# Altium project Arduino_MEGA_2560-Rev3.PrjPcb
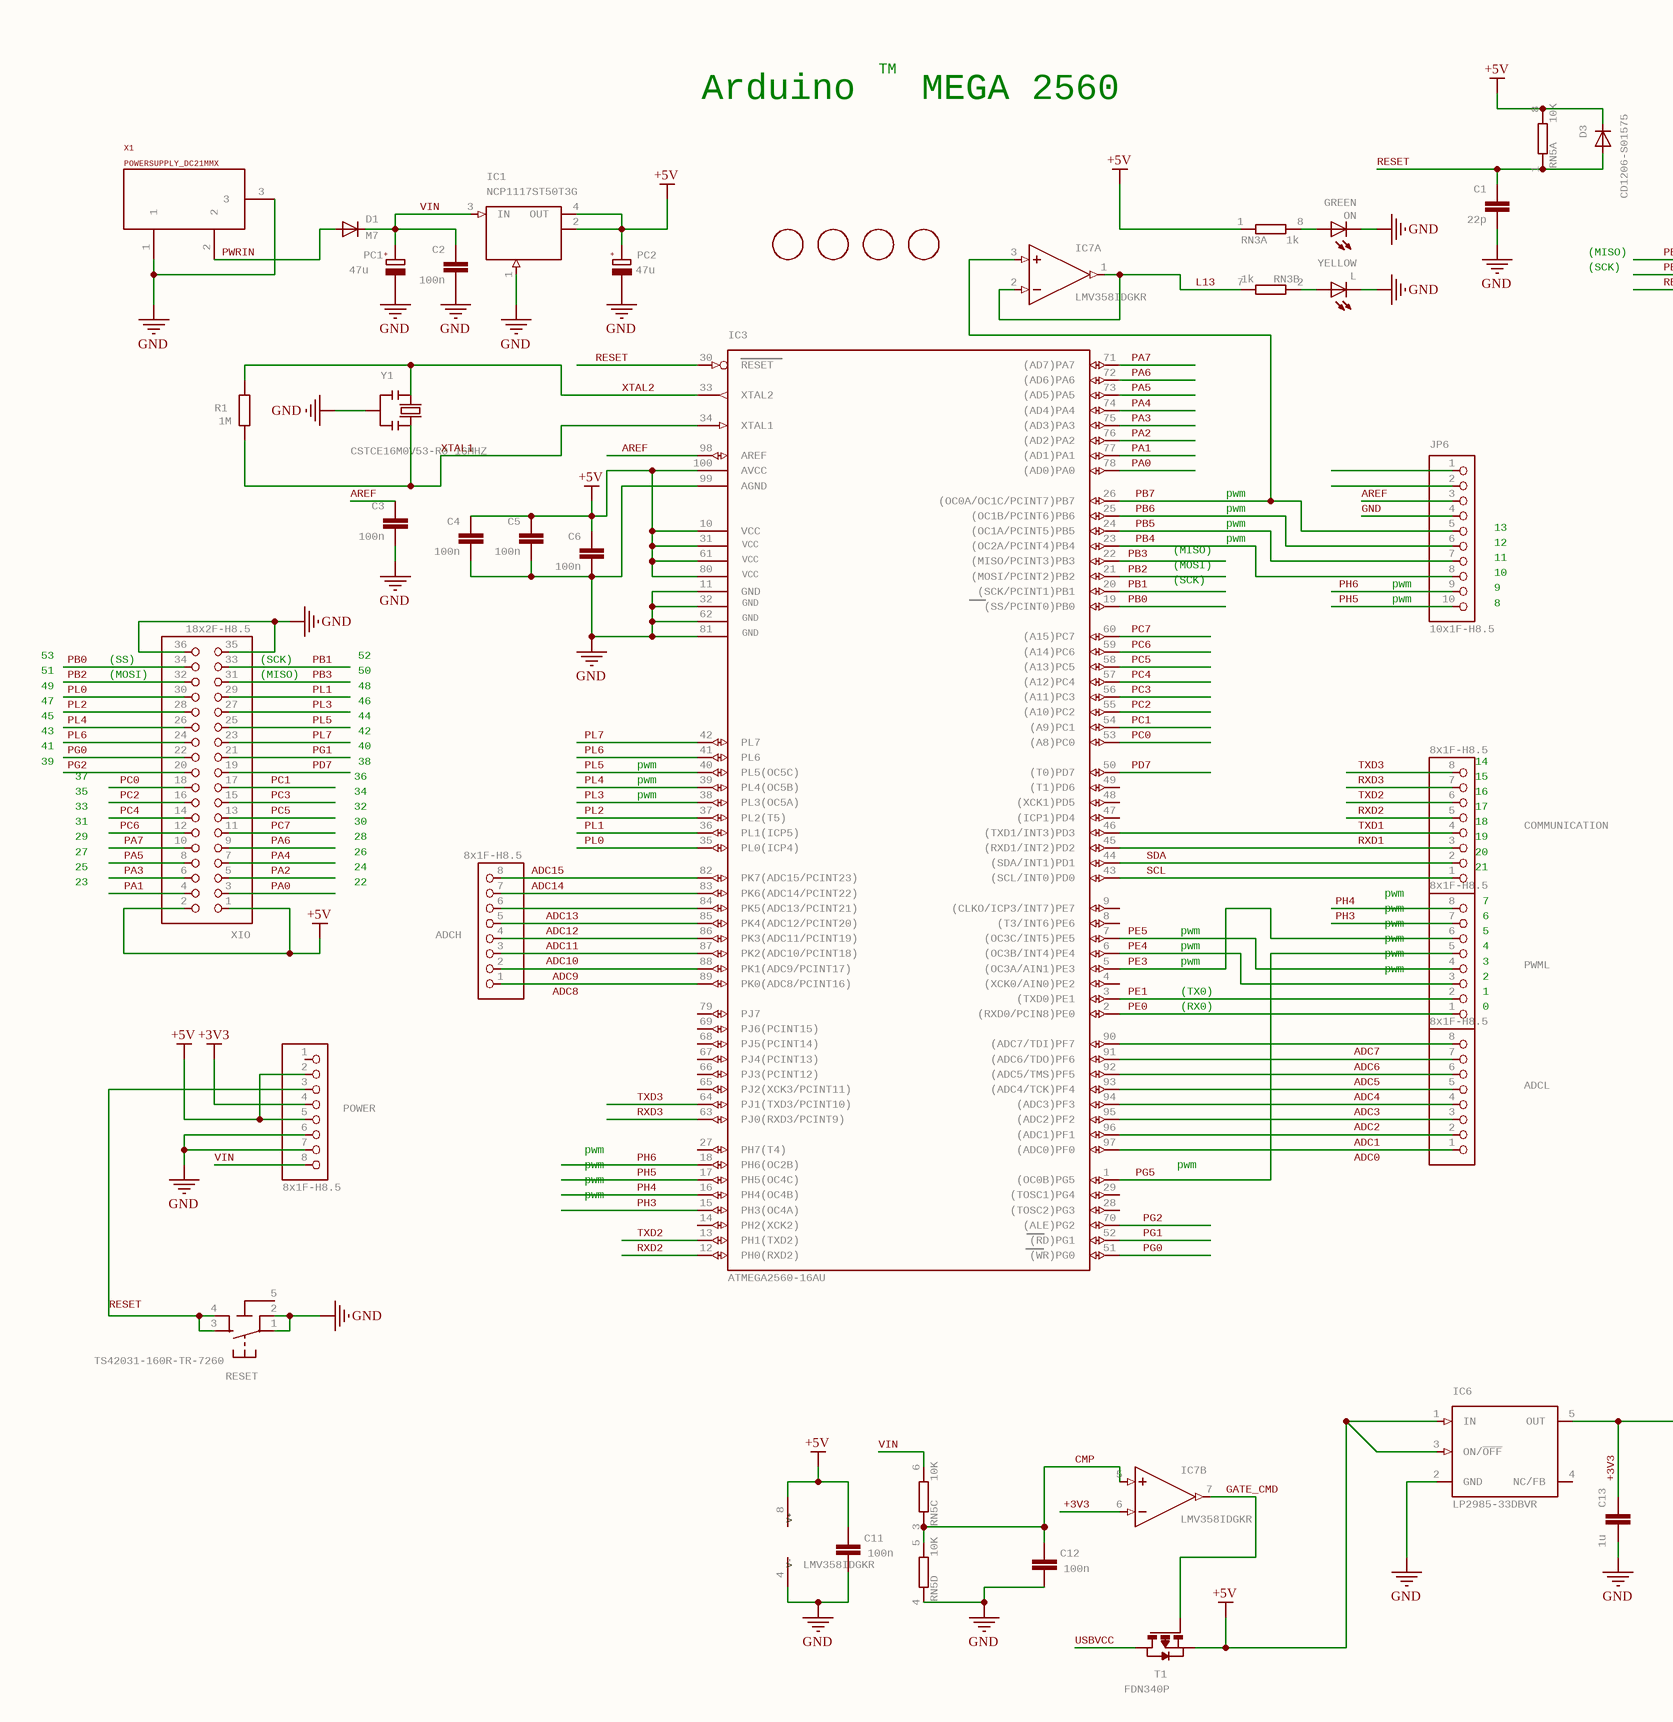
[diagram p0: Arduino_MEGA_2560-Rev3.SchDoc, left]
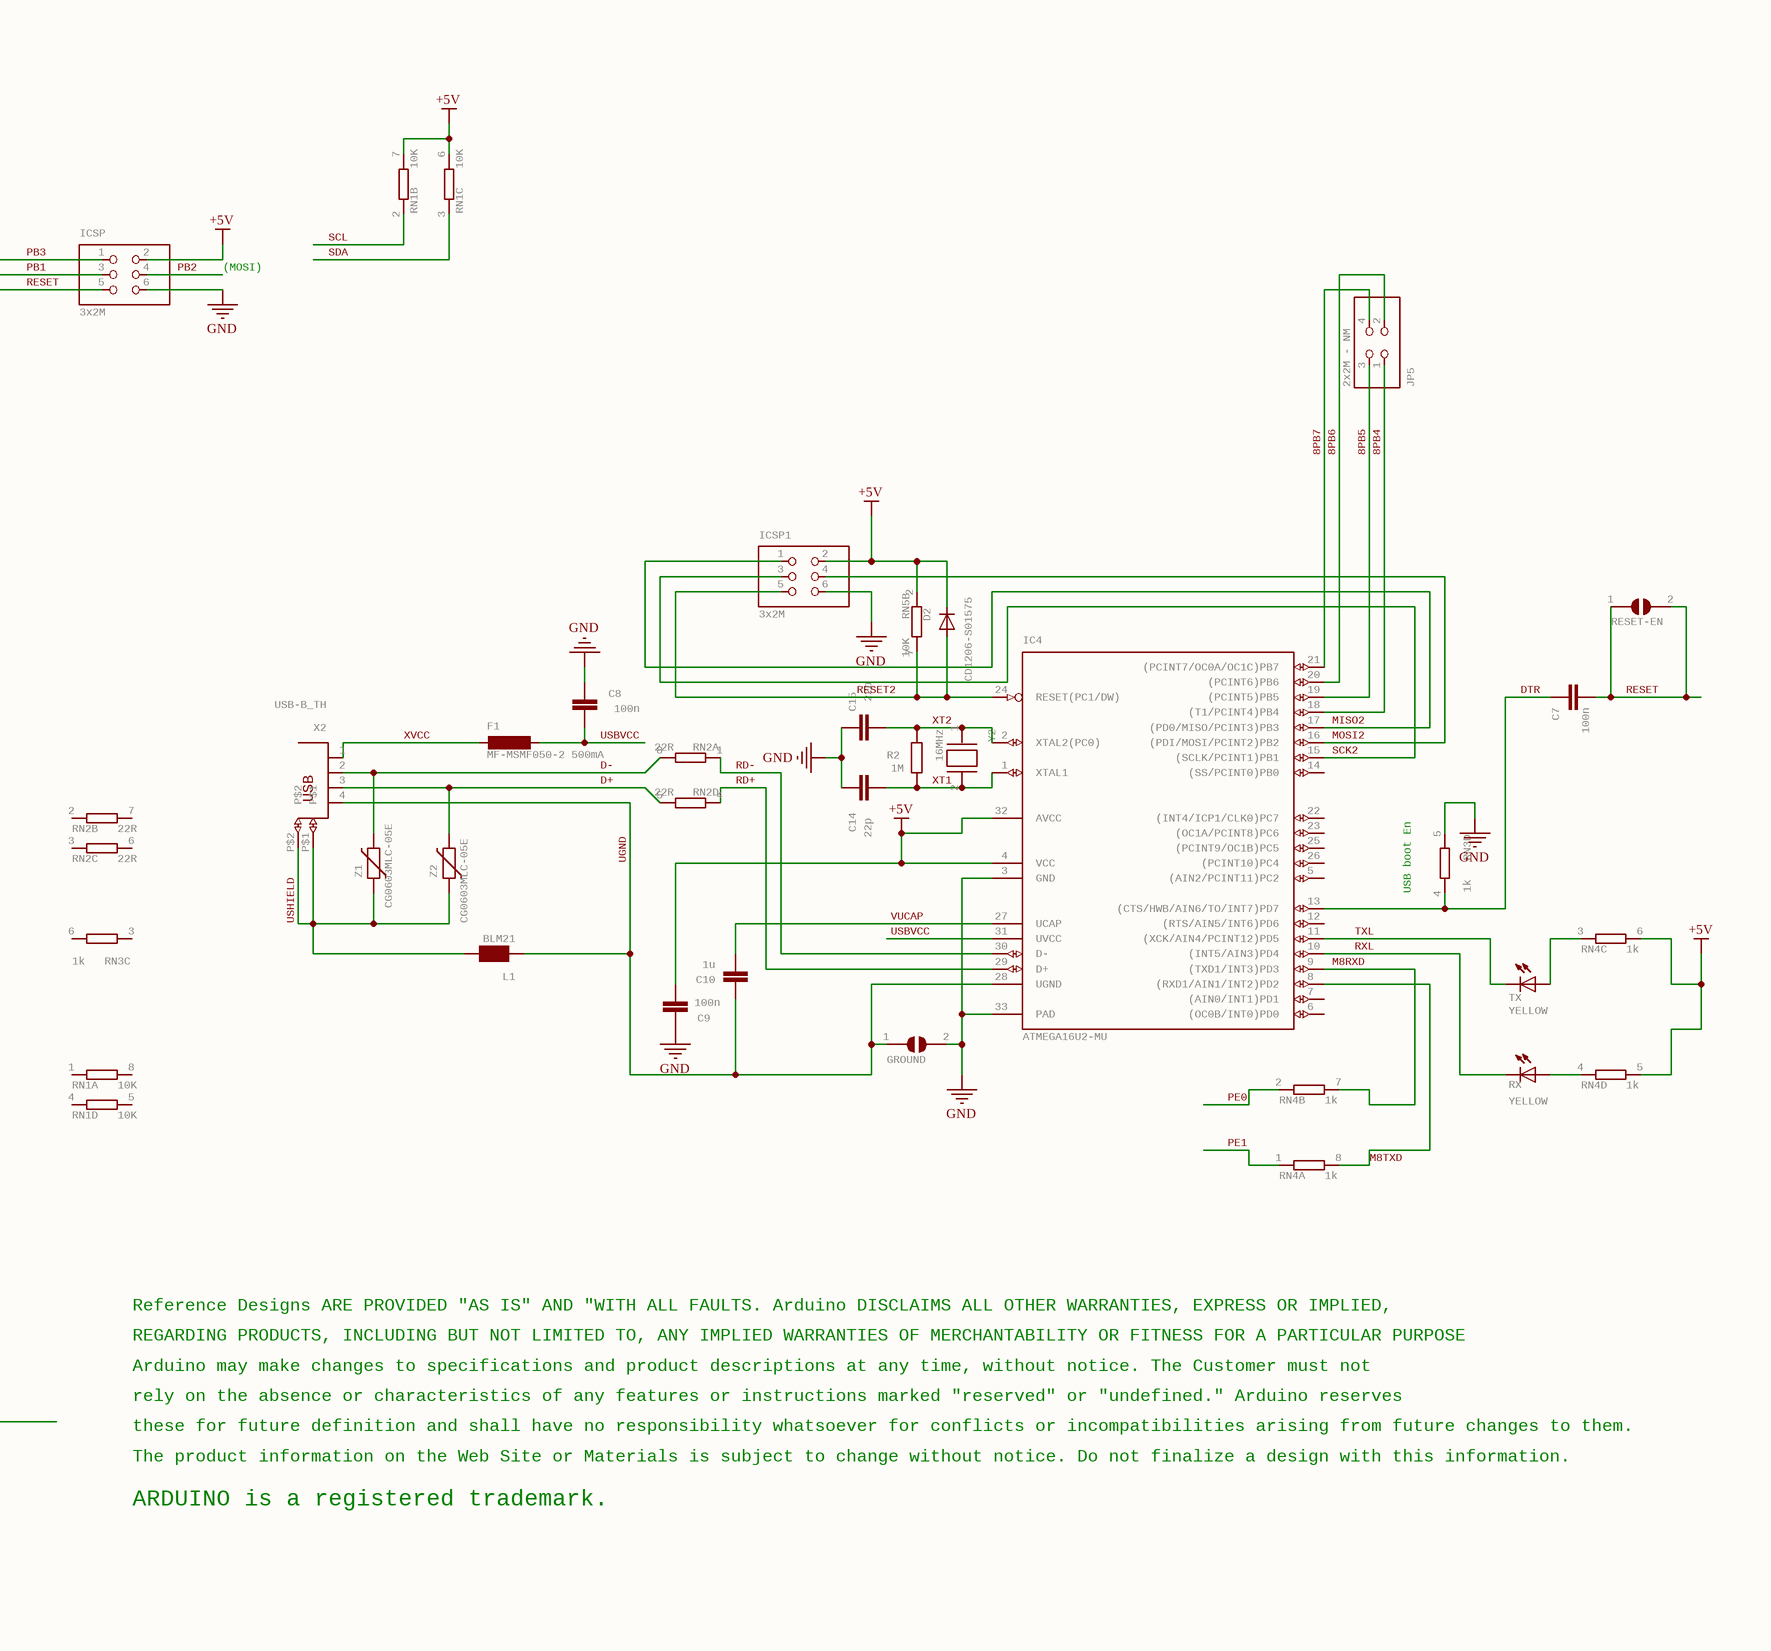
[diagram p1: Arduino_MEGA_2560-Rev3.SchDoc, right]
1 sheet, 63 parts. Net scope: global (net labels, ports and power ports of the same name join across sheets).
Board file: Arduino_MEGA_2560-Rev3.PcbDoc

## Sheet Arduino_MEGA_2560-Rev3.SchDoc
size 586 x 311 mm; Origin: Eagle

### Parts
ADCH  8x1F-H8.5  [1X08]
ADCL  8x1F-H8.5  [1X08]
C1  22p  [C0603-ROUND]
C2  100n  [C0603-ROUND]
C3  100n  [C0603-ROUND]
C4  100n  [C0603-ROUND]
C5  100n  [C0603-ROUND]
C6  100n  [C0603-ROUND]
C7  100n  [C0603-ROUND]
C8  100n  [C0603-ROUND]
C9  100n  [C0603-ROUND]
C10  1u  [C0603-ROUND]
C11  100n  [C0603-ROUND]
C12  100n  [C0603-ROUND]
C13  1u  [C0603-ROUND]
C14  22p  [C0603-ROUND]
C15  22p  [C0603-ROUND]
COMMUNICATION  8x1F-H8.5  [1X08]
D1  M7  [SMB]
D2  CD1206-S01575  [MINIMELF]
D3  CD1206-S01575  [MINIMELF]
F1  MF-MSMF050-2 500mA  [L1812]
FD1  FIDUCIALMOUNT  [FIDUCIA-MOUNT]  (value not drawn)
FD2  FIDUCIALMOUNT  [FIDUCIA-MOUNT]  (value not drawn)
FD3  FIDUCIALMOUNT  [FIDUCIA-MOUNT]  (value not drawn)
FD4  FIDUCIALMOUNT  [FIDUCIA-MOUNT]  (value not drawn)
GROUND  SJ  [SJ]  (value not drawn)
IC1  NCP1117ST50T3G  [SOT223]
IC3  ATMEGA2560-16AU  [TQFP100]
IC4  ATMEGA16U2-MU  [MLF32]
IC6  LP2985-33DBVR  [SOT23-DBV]
IC7  LMV358IDGKR  [MSOP08]  (parts A,B,C of 3)
ICSP  3x2M  [2X03]
ICSP1  3x2M  [2X03]
JP5  2x2M - NM  [2X02]
JP6  10x1F-H8.5  [1X10]
L  YELLOW  [CHIP-LED0805]
L1  BLM21  [0805]
ON  GREEN  [CHIP-LED0805]
PC1  47u  [PANASONIC_D]
PC2  47u  [PANASONIC_D]
POWER  8x1F-H8.5  [1X08]
PWML  8x1F-H8.5  [1X08]
R1  1M  [R0603-ROUND]
R2  1M  [R0603-ROUND]
RESET  TS42031-160R-TR-7260  [TS42]
RESET-EN  SJ  [SJ]  (value not drawn)
RN1  10K  [CAT16]  (parts A,B,C,D of 4)
RN2  22R  [CAY16]  (parts A,B,C,D of 4)
RN3  1k  [CAY16]  (parts A,B,C,D of 4)
RN4  1k  [CAY16]  (parts A,B,C,D of 4)
RN5  10K  [CAT16]  (parts A,B,C,D of 4)
RX  YELLOW  [CHIP-LED0805]
T1  FDN340P  [SOT-23]
TX  YELLOW  [CHIP-LED0805]
U$1  ReferenceDesignsAREPROVIDED"ASIS"AND"WITHALLFAULTS.ArduinoDISCLAIMSALLOTHERWARRANTIES,EXPRESSORIMPLIED,: Reference Designs ARE PROVIDED "AS IS" AND "WITH ALL FAULTS. Arduino DISCLAIMS ALL OTHER WARRANTIES, EXPRESS OR IMPLIED,  Arduinomaymakechangestospecificationsandproductdescriptionsatanytime,withoutnotice.TheCustomermustnot: Arduino may make changes to specifications and product descriptions at any time, without notice. The Customer must not  REGARDINGPRODUCTS,INCLUDINGBUTNOTLIMITEDTO,ANYIMPLIEDWARRANTIESOFMERCHANTABILITYORFITNESSFORAPARTICULARPURPOSE: REGARDING PRODUCTS, INCLUDING BUT NOT LIMITED TO, ANY IMPLIED WARRANTIES OF MERCHANTABILITY OR FITNESS FOR A PARTICULAR PURPOSE  relyontheabsenceorcharacteristicsofanyfeaturesorinstructionsmarked"reserved"or"undefined."Arduinoreserves: rely on the absence or characteristics of any features or instructions marked "reserved" or "undefined." Arduino reserves  theseforfuturedefinitionandshallhavenoresponsibilitywhatsoeverforconflictsorincompatibilitiesarisingfromfuturechangestothem.: these for future definition and shall have no responsibility whatsoever for conflicts or incompatibilities arising from future changes to them.  TheproductinformationontheWebSiteorMaterialsissubjecttochangewithoutnotice.Donotfinalizeadesignwiththisinformation.: The product information on the Web Site or Materials is subject to change without notice. Do not finalize a design with this information.  ARDUINOisaregisteredtrademark.: ARDUINO is a registered trademark.  [DISCLAIMER]  (hidden comment: DISCLAIMER)
X1  POWERSUPPLY_DC21MMX  [POWERSUPPLY_DC-21MM]
X2  USB-B_TH  [PN61729]
XIO  18x2F-H8.5  [2X18]
Y1  CSTCE16M0V53-R0 16MHZ  [RESONATOR]
Y2  16MHz  [QS]
Z1  CG0603MLC-05E  [CT/CN0603]
Z2  CG0603MLC-05E  [CT/CN0603]

### Nets
+3V3: C13.2 IC6.5(OUT) IC7.6(-IN) POWER.4
+5V: C4.1 C5.1 C6.1 C9.1 C11.2 D2.C D3.C IC1.2(OUT) IC1.4(OUT) IC3.10(VCC) IC3.31(VCC1) IC3.61(VCC2) IC3.80(VCC3) IC3.100(AVCC) IC4.4(VCC) IC4.32(AVCC) IC6.1(IN) IC6.3(ON/~{OFF}) IC7.8(V+) ICSP.2 ICSP1.2 PC2.+ POWER.2 POWER.5 RN1.6 RN1.7 RN3.1 RN4.5 RN4.6 RN5.2 RN5.8 T1.2(S) XIO.1 XIO.2
GND: C1.2 C2.2 C3.2 C4.2 C5.2 C6.2 C8.2 C9.2 C11.1 C12.1 C13.1 C14.2 C15.2 GROUND.2 IC1.1(GND/ADJ) IC3.11(GND) IC3.32(GND1) IC3.62(GND2) IC3.81(GND3) IC3.99(AGND) IC4.3(GND) IC4.33(PAD) IC6.2(GND) IC7.4(V-) ICSP.6 ICSP1.6 JP6.4 L.C ON.C PC1.- PC2.- POWER.6 POWER.7 RESET.1 RESET.2 RN3.5 RN5.4 X1.1 X1.3 XIO.35 XIO.36 Y1.2
8PB4: IC4.18((T1/PCINT4)PB4) JP5.1
8PB5: IC4.19((PCINT5)PB5) JP5.3
8PB6: IC4.20((PCINT6)PB6) JP5.2
8PB7: IC4.21((PCINT7/OC0A/OC1C)PB7) JP5.4
ADC0: ADCL.1 IC3.97((ADC0)PF0)
ADC1: ADCL.2 IC3.96((ADC1)PF1)
ADC2: ADCL.3 IC3.95((ADC2)PF2)
ADC3: ADCL.4 IC3.94((ADC3)PF3)
ADC4: ADCL.5 IC3.93((ADC4/TCK)PF4)
ADC5: ADCL.6 IC3.92((ADC5/TMS)PF5)
ADC6: ADCL.7 IC3.91((ADC6/TDO)PF6)
ADC7: ADCL.8 IC3.90((ADC7/TDI)PF7)
ADC8: ADCH.1 IC3.89(PK0(ADC8/PCINT16))
ADC9: ADCH.2 IC3.88(PK1(ADC9/PCINT17))
ADC10: ADCH.3 IC3.87(PK2(ADC10/PCINT18))
ADC11: ADCH.4 IC3.86(PK3(ADC11/PCINT19))
ADC12: ADCH.5 IC3.85(PK4(ADC12/PCINT20))
ADC13: ADCH.6 IC3.84(PK5(ADC13/PCINT21))
ADC14: ADCH.7 IC3.83(PK6(ADC14/PCINT22))
ADC15: ADCH.8 IC3.82(PK7(ADC15/PCINT23))
AREF: C3.1 IC3.98(AREF) JP6.3
CMP: C12.2 IC7.5(+IN) RN5.3 RN5.5
D+: RN2.5 X2.3 Z2.2
D-: RN2.8 X2.2 Z1.2
DTR: C7.1 IC4.13((CTS/HWB/AIN6/TO/INT7)PD7) RN3.4
GATE_CMD: IC7.7(OUT) T1.3(G)
L13: IC7.1(OUT) IC7.2(-IN) RN3.7
M8RXD: IC4.9((TXD1/INT3)PD3) RN4.7
M8TXD: IC4.8((RXD1/AIN1/INT2)PD2) RN4.8
MISO2: IC4.17((PD0/MISO/PCINT3)PB3) ICSP1.1
MOSI2: IC4.16((PDI/MOSI/PCINT2)PB2) ICSP1.4
PA0: IC3.78((AD0)PA0) XIO.3
PA1: IC3.77((AD1)PA1) XIO.4
PA2: IC3.76((AD2)PA2) XIO.5
PA3: IC3.75((AD3)PA3) XIO.6
PA4: IC3.74((AD4)PA4) XIO.7
PA5: IC3.73((AD5)PA5) XIO.8
PA6: IC3.72((AD6)PA6) XIO.9
PA7: IC3.71((AD7)PA7) XIO.10
PB0: IC3.19((SS/PCINT0)PB0) XIO.34
PB1: IC3.20((SCK/PCINT1)PB1) ICSP.3 XIO.33
PB2: IC3.21((MOSI/PCINT2)PB2) ICSP.4 XIO.32
PB3: IC3.22((MISO/PCINT3)PB3) ICSP.1 XIO.31
PB4: IC3.23((OC2A/PCINT4)PB4) JP6.8
PB5: IC3.24((OC1A/PCINT5)PB5) JP6.7
PB6: IC3.25((OC1B/PCINT6)PB6) JP6.6
PB7: IC3.26((OC0A/OC1C/PCINT7)PB7) IC7.3(+IN) JP6.5
PC0: IC3.53((A8)PC0) XIO.18
PC1: IC3.54((A9)PC1) XIO.17
PC2: IC3.55((A10)PC2) XIO.16
PC3: IC3.56((A11)PC3) XIO.15
PC4: IC3.57((A12)PC4) XIO.14
PC5: IC3.58((A13)PC5) XIO.13
PC6: IC3.59((A14)PC6) XIO.12
PC7: IC3.60((A15)PC7) XIO.11
PD7: IC3.50((T0)PD7) XIO.19
PE0: IC3.2((RXD0/PCIN8)PE0) PWML.1 RN4.2
PE1: IC3.3((TXD0)PE1) PWML.2 RN4.1
PE3: IC3.5((OC3A/AIN1)PE3) PWML.6
PE4: IC3.6((OC3B/INT4)PE4) PWML.3
PE5: IC3.7((OC3C/INT5)PE5) PWML.4
PG0: IC3.51((WR)PG0) XIO.22
PG1: IC3.52((RD)PG1) XIO.21
PG2: IC3.70((ALE)PG2) XIO.20
PG5: IC3.1((OC0B)PG5) PWML.5
PH3: IC3.15(PH3(OC4A)) PWML.7
PH4: IC3.16(PH4(OC4B)) PWML.8
PH5: IC3.17(PH5(OC4C)) JP6.10
PH6: IC3.18(PH6(OC2B)) JP6.9
PL0: IC3.35(PL0(ICP4)) XIO.30
PL1: IC3.36(PL1(ICP5)) XIO.29
PL2: IC3.37(PL2(T5)) XIO.28
PL3: IC3.38(PL3(OC5A)) XIO.27
PL4: IC3.39(PL4(OC5B)) XIO.26
PL5: IC3.40(PL5(OC5C)) XIO.25
PL6: IC3.41(PL6) XIO.24
PL7: IC3.42(PL7) XIO.23
PWRIN: D1.A X1.2
RD+: IC4.29(D+) RN2.4
RD-: IC4.30(D-) RN2.1
RESET: C1.1 C7.2 D3.A IC3.30(RESET) ICSP.5 POWER.3 RESET.3 RESET.4 RESET-EN.1 RESET-EN.2 RN5.1
RESET2: D2.A IC4.24(RESET(PC1/DW)) ICSP1.5 RN5.7
RXD1: COMMUNICATION.3 IC3.45((RXD1/INT2)PD2)
RXD2: COMMUNICATION.5 IC3.12(PH0(RXD2))
RXD3: COMMUNICATION.7 IC3.63(PJ0(RXD3/PCINT9))
RXL: IC4.10((INT5/AIN3)PD4) RX.C
SCK2: IC4.15((SCLK/PCINT1)PB1) ICSP1.3
SCL: COMMUNICATION.1 IC3.43((SCL/INT0)PD0) RN1.2
SDA: COMMUNICATION.2 IC3.44((SDA/INT1)PD1) RN1.3
TXD1: COMMUNICATION.4 IC3.46((TXD1/INT3)PD3)
TXD2: COMMUNICATION.6 IC3.13(PH1(TXD2))
TXD3: COMMUNICATION.8 IC3.64(PJ1(TXD3/PCINT10))
TXL: IC4.11((XCK/AIN4/PCINT12)PD5) TX.C
UGND: C10.2 GROUND.1 IC4.28(UGND) L1.1 X2.4
USBVCC: C8.1 F1.1 IC4.31(UVCC) T1.1(D)
USHIELD: L1.2 X2.P$1 X2.P$2 Z1.1 Z2.1
VIN: C2.1 D1.C IC1.3(IN) PC1.+ POWER.8 RN5.6
VUCAP: C10.1 IC4.27(UCAP)
XT1: C14.1 IC4.1(XTAL1) R2.1 Y2.2
XT2: C15.1 IC4.2(XTAL2(PC0)) R2.2 Y2.1
XTAL1: IC3.34(XTAL1) R1.1 Y1.3
XTAL2: IC3.33(XTAL2) R1.2 Y1.1
XVCC: F1.2 X2.1
NetL_A: L.A RN3.2
NetON_A: ON.A RN3.8
NetRN4_3: RN4.3 TX.A
NetRN4_4: RN4.4 RX.A

Not connected (* = marked no-connect by the designer): IC3 4((XCK0/AIN0)PE2) 8((T3/INT6)PE6) 9((CLKO/ICP3/INT7)PE7) 14(PH2(XCK2)) 27(PH7(T4)) 28((TOSC2)PG3) 29((TOSC1)PG4) 47((ICP1)PD4) 48((XCK1)PD5) 49((T1)PD6) 65(PJ2(XCK3/PCINT11)) 66(PJ3(PCINT12)) 67(PJ4(PCINT13)) 68(PJ5(PCINT14)) 69(PJ6(PCINT15)) 79(PJ7); IC4 5((AIN2/PCINT11)PC2) 6((OC0B/INT0)PD0) 7((AIN0/INT1)PD1) 12((RTS/AIN5/INT6)PD6) 14((SS/PCINT0)PB0) 22((INT4/ICP1/CLK0)PC7) 23((OC1A/PCINT8)PC6) 25((PCINT9/OC1B)PC5) 26((PCINT10)PC4); IC6 4(NC/FB); JP6 1 2; POWER 1; RESET 5(5-GND); RN1 1 4(1) 5(2) 8(2); RN2 2(1) 3(1) 6(2) 7(2); RN3 3(1) 6(2)

### Notes on the sheet
- TM
- Arduino   MEGA 2560
- (SCK)
- (MISO)
- (MOSI)
- pwm
- (near JP6) 12
- (near JP6) 13
- (near JP6) pwm
- (near JP6) 8
- (near JP6) 9
- (near JP6) 10
- (near JP6) 11
- 51
- 53
- 49
- (SS)
- (near XIO) (MOSI)
- (near XIO) (SCK)
- (near XIO) (MISO)
- 52
- 50
- 48
- 47
- 45
- 43
- 41
- 39
- 46
- 44
- 42
- 40
- 38
- (near COMMUNICATION) 14
- 29
- 31
- 33
- 35
- 37
- 28
- 30
- 32
- 34
- 36
- (near COMMUNICATION) 15
- (near COMMUNICATION) 16
- (near COMMUNICATION) 17
- (near COMMUNICATION) 18
- (near COMMUNICATION) 19
- 23
- 25
- 27
- 22
- 24
- 26
- (near COMMUNICATION) 20
- (near COMMUNICATION) 21
- (near PWML) 6
- 7
- (near RN3) USB boot En
- (TX0)
- (near PWML) 1
- (near PWML) 2
- (near PWML) 3
- (near PWML) 4
- (near PWML) 5
- (RX0)
- (near PWML) 0

### Library data of the parts
ADCH ADCL COMMUNICATION POWER PWML = PINHD-1X8: PIN HEADER; GateName_1: A; SymbolName_1: PINHD8; LibraryName: SmartPrj; DeviceSetName: PINHD-1X8
C1-C15 = C-EU0603-RND: CAPACITOR, European symbol; GateName_1: G$1; SymbolName_1: C-EU; DeviceName: 0603-RND; LibraryName: SmartPrj; DeviceSetName: C-EU
D1 = DIODE-SMB: DIODE; GateName_1: G$1; SymbolName_1: D; DeviceSetName: DIODE-; DeviceName: SMB; LibraryName: diode
D2 D3 = DIODE-MINIMELF: DIODE; GateName_1: G$1; SymbolName_1: D; DeviceSetName: DIODE-; DeviceName: MINIMELF; LibraryName: diode
F1 = L-EUL1812: INDUCTOR, European symbol; GateName_1: G$1; SymbolName_1: L-EU; DeviceName: L1812; LibraryName: rcl; DeviceSetName: L-EU
FD1-FD4 = FIDUCIALMOUNT: GateName_1: G$1; SymbolName_1: FIDUCIAL; LibraryName: SmartPrj; DeviceSetName: FIDUCIALMOUNT
GROUND RESET-EN = SJ: SMD solder JUMPER; GateName_1: 1; SymbolName_1: SJ; LibraryName: jumper; DeviceSetName: SJ
IC1 = MC33269ST*: Adjustable Output Low Dropout Voltage Regulator 800 mA   Source: http://www.onsemi.com/pub/Collateral/MC33269-D.PDF; GateName_1: G$1; SymbolName_1: VREG-O2; LibraryName: linear; DeviceSetName: MC33269ST*
IC3 = ATMEGA2560AU: MICROCONTROLLER   64/128/256 Kbytes FLASH   4 Kbytes EEPROM   8 Kbytes SRAM   86 General Purpose I/O pins   12-channels16-bit PWM   4 x Serial USARTs   16-channels 10-bit A/D; GateName_1: 1; SymbolName_1: 86-I/O-1; DeviceName: AU; LibraryName: SmartPrj; DeviceSetName: ATMEGA2560; GND: GND; VCC: VCC
IC4 = ATMEGA16U2-MU: GateName_1: G$1; SymbolName_1: ATMEL_MEGA8U2; DeviceName: MU; LibraryName: SmartPrj; DeviceSetName: ATMEGA16U2-
IC6 = LP2985-XXDBVR: ULTRALOW-POWER 50-mA LOW-DROPOUT LINEAR REGULATORS   50-mA Low-Dropout Regulator Source: http://focus.ti.com/lit/ds/symlink/tps77001.pdf; GateName_1: G$1; SymbolName_1: LP2985-XXDBVR; LibraryName: SmartPrj; DeviceSetName: LP2985-XXDBVR
IC7 = LMV358?*MM: Dual General Purpose, Low Voltage, Rail-to-Rail Output Operational Amplifiers   Source: http://www.national.com/mpf/LM/LMV321.html http://www.national.com/dt/lmv_qual.pdf; GateName_1: A; SymbolName_1: OPAMP; GateName_2: B; GateName_3: P; SymbolName_3: PWR+-; DeviceName: MM; SymbolName_2: OPAMP; LibraryName: linear; DeviceSetName: LMV358?*
ICSP ICSP1 = PINHD-2X3: PIN HEADER; GateName_1: A; SymbolName_1: PINH2X3; LibraryName: SmartPrj; DeviceSetName: PINHD-2X3
JP5 = PINHD-2X2: PIN HEADER; GateName_1: A; SymbolName_1: PINH2X2; LibraryName: SmartPrj; DeviceSetName: PINHD-2X2
JP6 = PINHD-1X10_ARD: PIN HEADER; GateName_1: A; SymbolName_1: PINHD10; LibraryName: SmartPrj; DeviceSetName: PINHD-1X10_ARD
L ON RX TX = LEDCHIP-LED0805: LED   OSRAM: - CHIPLED LG R971, LG N971, LY N971, LG Q971, LY Q971, LO R971, LY R971 LH N974, LH R974 LS Q976, LO Q976, LY Q976 LO Q996 - Hyper CHIPLED LW Q18S LB Q993, LB Q99A, LB R99A - SideLED LS A670, LO A670, LY A670, LG A670, LP A670 LB A673, LV A673, LT A673, LW A673 LH A674 LY A675 LS A676, LA A676, LO A676, LY A676, LW A676 LS A679, LY A679, LG A679 -  Hyper Micro SIDELEDÂ® LS Y876, LA Y876, LO Y876, LY Y876 LT Y87S - SmartLED LW L88C, LW L88S LB L89C, LB L89S, LG L890 LS L89K, LO L89K, LY L89K LS L896, LA L896, LO L896, LY L896 - TOPLED LS T670, LO T670, LY T670, LG T670, LP T670 LSG T670, LSP T670, LSY T670, LOP T670, LYG T670 LG T671, LOG T671, LSG T671 LB T673, LV T673, LT T673, LW T673 LH T674 LS T676, LA T676, LO T676, LY T676, LB T676, LH T676, LSB T676, LW T676 LB T67C, LV T67C, LT T67C, LS T67K, LO T67K, LY T67K, LW E67C LS E67B, LA E67B, LO E67B, LY E67B, LB E67C, LV E67C, LT E67C LW T67C LS T679, LY T679, LG T679 LS T770, LO T770, LY T770, LG T770, LP T770 LB T773, LV T773, LT T773, LW T773 LH T774 LS E675, LA E675, LY E675, LS T675 LS T776, LA T776, LO T776, LY T776, LB T776 LHGB T686 LT T68C, LB T68C - Hyper Mini TOPLEDÂ® LB M676 - Mini TOPLED SantanaÂ® LG M470 LS M47K, LO M47K, LY M47K    Source: http://www.osram.convergy.de   LUXEON: - LUMILEDÂ® LXK2-PW12-R00, LXK2-PW12-S00, LXK2-PW14-U00, LXK2-PW14-V00 LXK2-PM12-R00, LXK2-PM12-S00, LXK2-PM14-U00 LXK2-PE12-Q00, LXK2-PE12-R00, LXK2-PE12-S00, LXK2-PE14-T00, LXK2-PE14-U00 LXK2-PB12-K00, LXK2-PB12-L00, LXK2-PB12-M00, LXK2-PB14-N00, LXK2-PB14-P00, LXK2-PB14-Q00 LXK2-PR12-L00, LXK2-PR12-M00, LXK2-PR14-Q00, LXK2-PR14-R00 LXK2-PD12-Q00, LXK2-PD12-R00, LXK2-PD12-S00 LXK2-PH12-R00, LXK2-PH12-S00 LXK2-PL12-P00, LXK2-PL12-Q00, LXK2-PL12-R00    Source: www.luxeon.com   KINGBRIGHT:   KA-3528ASYC Source: www.kingbright.com; GateName_1: G$1; SymbolName_1: LED; DeviceName: CHIP-LED0805; LibraryName: led; DeviceSetName: LED
L1 = WE-CBF_0805: SMD EMI Suppression Ferrite Beads - excellent anti-EMI properties - low DCR - impedances till 3000 ohms - rated current up to 6 A; GateName_1: G$1; SymbolName_1: L; DeviceName: _0805; DeviceSetName: WE-CBF; LibraryName: wuerth-elektronik
PC1 PC2 = CPOL-EUD: POLARIZED CAPACITOR, European symbol; GateName_1: G$1; SymbolName_1: CPOL; DeviceName: D; LibraryName: rcl; DeviceSetName: CPOL-EU; +: +
R1 R2 = R-EU_R0603: RESISTOR, European symbol; GateName_1: G$1; SymbolName_1: R-EU; DeviceName: R0603; DeviceSetName: R-EU_; LibraryName: SmartPrj
RESET = TS42: TS42 Dongnan Electronics Tact switch VDC 12V - 50mA; GateName_1: G$1; SymbolName_1: ST-MOD_V1.4_TS42; LibraryName: SmartPrj; DeviceSetName: TS42
RN1 RN5 = 4R-NCAT16: Array Chip Resistor   Source: RS Component / Phycomp; GateName_1: A; SymbolName_1: R1NV; GateName_2: B; GateName_3: C; GateName_4: D; DeviceSetName: 4R-N; SymbolName_2: R1NV; SymbolName_3: R1NV; SymbolName_4: R1NV; DeviceName: CAT16; LibraryName: resistor-dil
RN2-RN4 = 4R-NCAY16: Array Chip Resistor   Source: RS Component / Phycomp; GateName_1: A; SymbolName_1: R1NV; GateName_2: B; GateName_3: C; GateName_4: D; DeviceSetName: 4R-N; SymbolName_2: R1NV; SymbolName_3: R1NV; SymbolName_4: R1NV; DeviceName: CAY16; LibraryName: resistor-dil
T1 = PMOSSOT23: MOS FET; GateName_1: A; SymbolName_1: P_MOSFET; LibraryName: zetex; DeviceSetName: PMOSSOT23
U$1 = DISCLAIMER: GateName_1: G$1; SymbolName_1: DISCLAIMER; LibraryName: SmartPrj; DeviceSetName: DISCLAIMER
X1 = POWERSUPPLY_DC21MMX: GateName_1: G$1; SymbolName_1: POWERSUPPLY_DC21PWR; DeviceName: X; LibraryName: SmartPrj; DeviceSetName: POWERSUPPLY_DC21MM
X2 = PN61729: BERG USB connector; GateName_1: G$1; SymbolName_1: J11; LibraryName: SmartPrj; DeviceSetName: PN61729; USB: USB
XIO = PINHD-2X18: PIN HEADER; GateName_1: A; SymbolName_1: PINH2X18; LibraryName: SmartPrj; DeviceSetName: PINHD-2X18
Y1 = RESONATORMU: GateName_1: G$1; DeviceName: MU; SymbolName_1: RESONATOR; LibraryName: SmartPrj; DeviceSetName: RESONATOR
Y2 = XTAL/S: CRYSTAL; GateName_1: G$1; SymbolName_1: XTAL; LibraryName: SmartPrj; DeviceSetName: XTAL/S
Z1 Z2 = VARISTORCN0603: VARISTOR; GateName_1: G$1; DeviceName: CN0603; SymbolName_1: VARISTOR; LibraryName: varistor; DeviceSetName: VARISTOR